# EAGLE schematic Schemat (EAGLE 9.1.0)
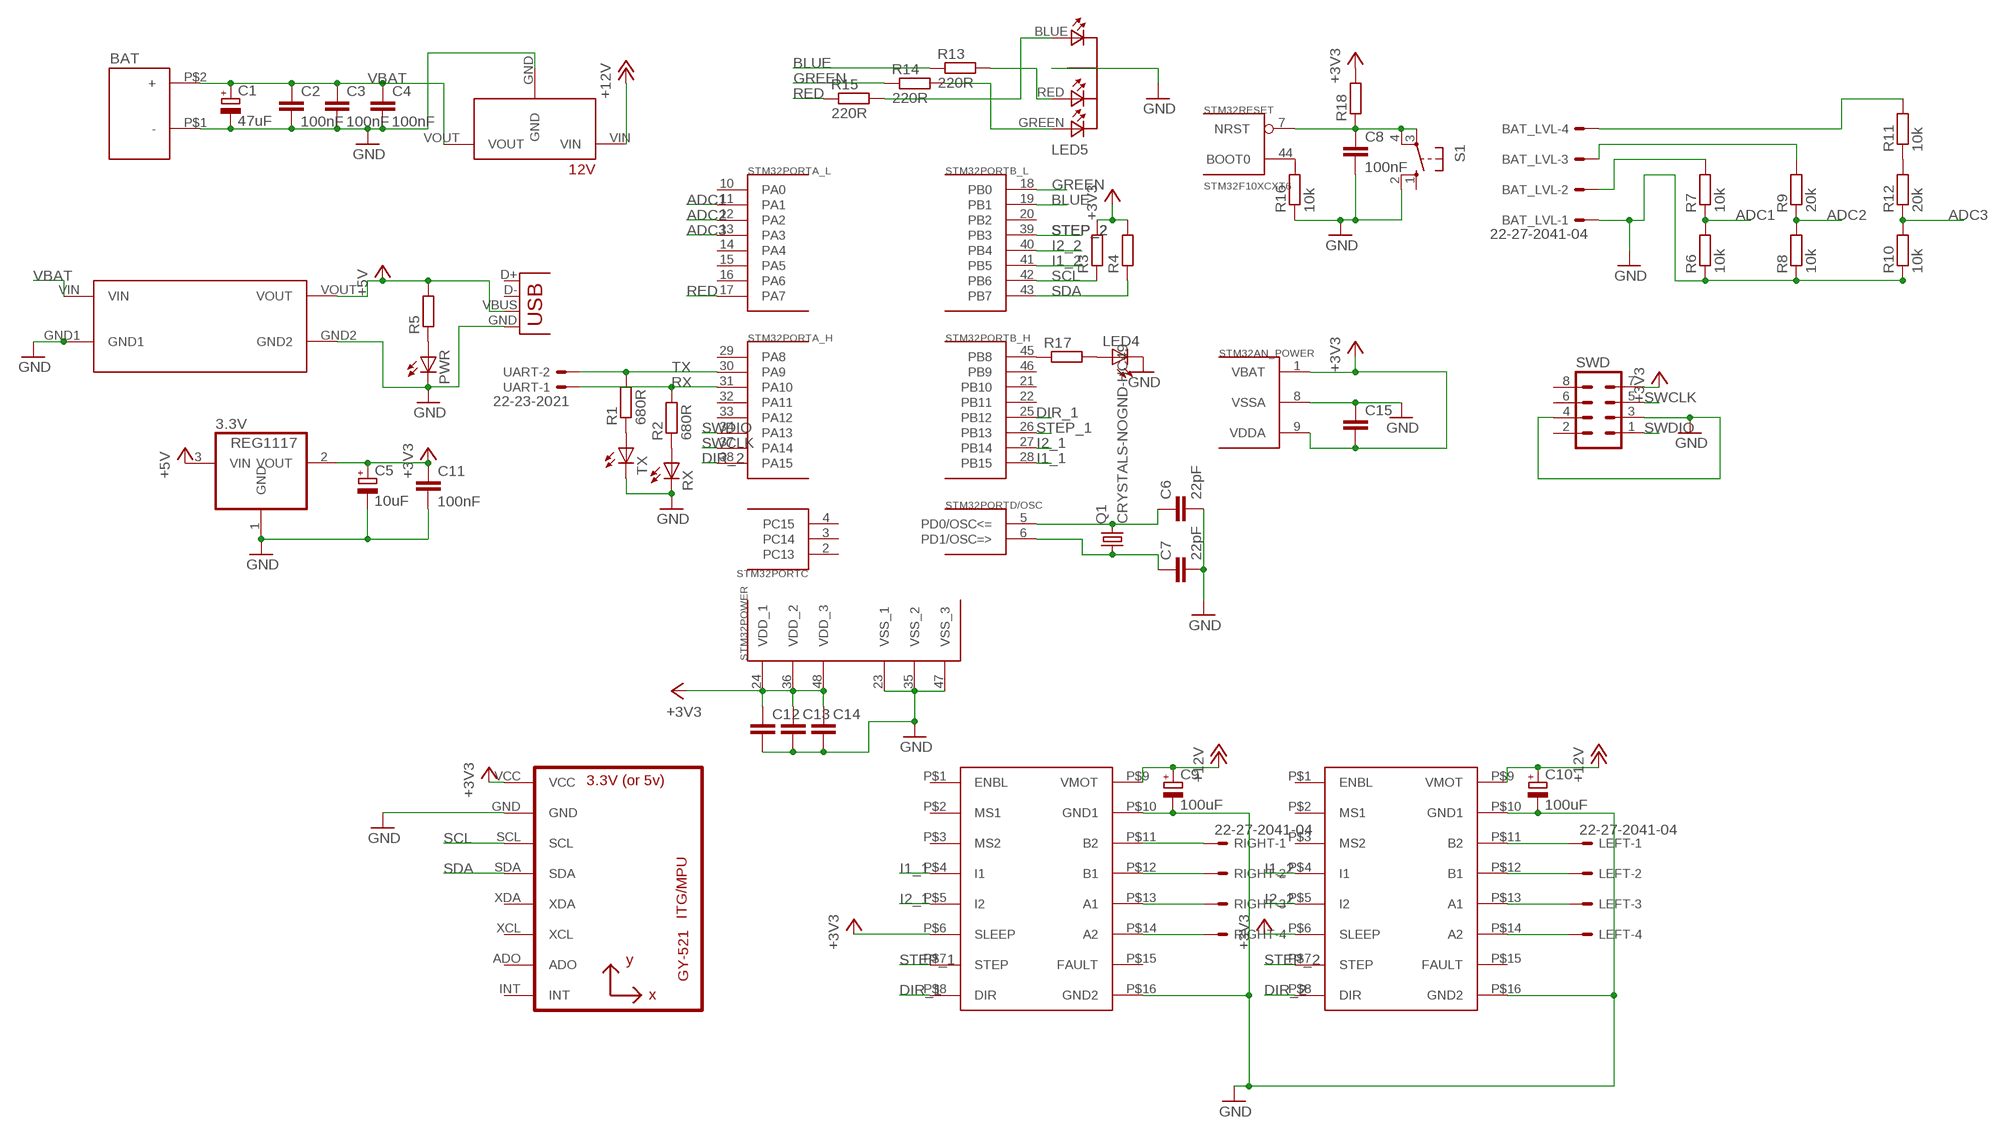
[diagram p0: schematic, sheet 1]

## Parts
3.3V  REG1117  [SOT223]
12V  12V_VOLTAGE_REGULATOR  9V_VOLTAGE_REGULATOR  [9V_VOLTAGE_REGULATOR]
BAT  DEANS  [DEAN]
BAT_LVL  22-27-2041-04  [6410-04]
C1  47uF  CPOL-EUE2-5  [E2-5]
C2  100nF  C-EUC0603K  [C0603K]
C3  100nF  C-EUC0603K  [C0603K]
C4  100nF  C-EUC0603K  [C0603K]
C5  10uF  CPOL-EUE2-5  [E2-5]
C6  22pF  C-EUC0603K  [C0603K]
C7  22pF  C-EUC0603K  [C0603K]
C8  100nF  C-EU050-030X075  [C050-030X075]
C9  100uF  CPOL-EUE2.5-7  [E2,5-7]
C10  100uF  CPOL-EUE2.5-7  [E2,5-7]
C11  100nF  C-EUC0603  [C0603]
C12  C-EU025-024X044  [C025-024X044]
C13  C-EU025-024X044  [C025-024X044]
C14  C-EU025-024X044  [C025-024X044]
C15  C-EU025-024X044  [C025-024X044]
DRV1  POLOLU-MP6500  [STEPPER-CARRIER]
DRV2  POLOLU-MP6500  [STEPPER-CARRIER]
LED4  LED5MM  [LED5MM]
LED5  LED-DIP-3  [DIP-4]
LEFT  22-27-2041-04  [6410-04]
PWR  LED5MM  [LED5MM]
Q1  CRYSTALS-NOGND-HC49  [HC49]
R1  680R  R-EU_R0805  [R0805]
R2  680R  R-EU_R0805  [R0805]
R3  R-EU_R0805  [R0805]
R4  R-EU_R0805  [R0805]
R5  R-EU_R0805  [R0805]
R6  10k  R-EU_R0805  [R0805]
R7  10k  R-EU_R0805  [R0805]
R8  10k  R-EU_R0805  [R0805]
R9  20k  R-EU_R0805  [R0805]
R10  10k  R-EU_R0805  [R0805]
R11  10k  R-EU_R0805  [R0805]
R12  20k  R-EU_R0805  [R0805]
R13  220R  R-EU_R0805  [R0805]
R14  220R  R-EU_R0805  [R0805]
R15  220R  R-EU_R0805  [R0805]
R16  10k  R-EU_R0805  [R0805]
R17  R-EU_R0805  [R0805]
R18  R-EU_R0805  [R0805]
RIGHT  22-27-2041-04  [6410-04]
RPI  USB-A-H  [USB-A-H]
RX  LEDSML0603  [SML0603]
S1  10-XX  [B3F-10XX]
STM32  STM32F10XCXT6  [TQFP48]
SWD  MA04-2  [MA04-2]
TX  LEDSML0603  [SML0603]
U1  GY-521MPU6050  [GY-521]
U$1  DC-DC  [DC-DC]
UART  22-23-2021  [22-23-2021]

## Nets
+3V3: 3.3V.2(VOUT) C5.+ C11.1 C12.1 C13.1 C14.1 C15.2 DRV1.P$6(SLEEP) DRV2.P$6(SLEEP) R3.2 R4.2 R18.2 STM32.1(AN_POWER:VBAT) STM32.9(AN_POWER:VDDA) STM32.24(POWER:VDD_1) STM32.36(POWER:VDD_2) STM32.48(POWER:VDD_3) SWD.7 U1.VCC
+5V: 3.3V.3(VIN) R5.2 RPI.VBUS U$1.VOUT
+12V: 12V.VIN C9.+ C10.+ DRV1.P$9(VMOT) DRV2.P$9(VMOT)
ADC1: R6.2 R7.1 STM32.11(PORTA_L:PA1)
ADC2: R8.2 R9.1 STM32.12(PORTA_L:PA2)
ADC3: R10.2 R12.1 STM32.13(PORTA_L:PA3)
BLUE: R13.1 STM32.19(PORTB_L:PB1)
DIR_1: DRV1.P$8(DIR) STM32.25(PORTB_H:PB12)
DIR_2: DRV2.P$8(DIR) STM32.38(PORTA_H:PA15)
GND: 3.3V.1(GND) 12V.GND BAT.P$1(-) BAT_LVL.1 C1.- C2.2 C3.2 C4.2 C5.- C6.2 C7.2 C8.2 C9.- C10.- C11.2 C12.2 C13.2 C14.2 C15.1 DRV1.P$10(GND1) DRV1.P$16(GND2) DRV2.P$10(GND1) DRV2.P$16(GND2) LED4.K(C) LED5.COMMON_CATHODE(COM-CATHODE) PWR.K(C) R6.1 R8.1 R10.1 R16.1 RPI.GND RX.C S1.2(S1) STM32.8(AN_POWER:VSSA) STM32.23(POWER:VSS_1) STM32.35(POWER:VSS_2) STM32.47(POWER:VSS_3) SWD.3 SWD.4 TX.C U1.GND U$1.GND1 U$1.GND2
GREEN: R14.1 STM32.18(PORTB_L:PB0)
I1_1: DRV1.P$4(I1) STM32.28(PORTB_H:PB15)
I1_2: DRV2.P$4(I1) STM32.41(PORTB_L:PB5)
I2_1: DRV1.P$5(I2) STM32.27(PORTB_H:PB14)
I2_2: DRV2.P$5(I2) STM32.40(PORTB_L:PB4)
N$1: R1.1 TX.A
N$2: R2.1 RX.A
N$3: R16.2 STM32.44(RESET:BOOT0)
N$4: C7.1 Q1.1 STM32.6(PORTD/OSC:PD1/OSC=>)
N$5: LED5.GREEN R14.2
N$6: BAT_LVL.2 R7.2
N$7: PWR.A R5.1
N$8: BAT_LVL.3 R9.2
N$9: R11.1 R12.2
N$10: BAT_LVL.4 R11.2
N$11: C8.1 R18.1 S1.3(P) S1.4(P1) STM32.7(RESET:NRST)
N$13: R17.1 STM32.45(PORTB_H:PB8)
N$14: LED4.A R17.2
N$15: LED5.RED R13.2
N$16: DRV2.P$11(B2) LEFT.1
N$17: LED5.BLUE R15.2
N$18: DRV1.P$12(B1) RIGHT.2
N$19: DRV2.P$12(B1) LEFT.2
N$20: DRV2.P$13(A1) LEFT.3
N$21: DRV2.P$14(A2) LEFT.4
N$22: DRV1.P$11(B2) RIGHT.1
N$23: DRV1.P$13(A1) RIGHT.3
N$24: DRV1.P$14(A2) RIGHT.4
N$26: C6.1 Q1.2 STM32.5(PORTD/OSC:PD0/OSC<=)
RED: R15.1 STM32.17(PORTA_L:PA7)
RX: R2.2 STM32.31(PORTA_H:PA10) UART.1
SCL: R3.1 STM32.42(PORTB_L:PB6) U1.SCL
SDA: R4.1 STM32.43(PORTB_L:PB7) U1.SDA
STEP_1: DRV1.P$7(STEP) STM32.26(PORTB_H:PB13)
STEP_2: DRV2.P$7(STEP) STM32.39(PORTB_L:PB3)
SWCLK: STM32.37(PORTA_H:PA14) SWD.5
SWDIO: STM32.34(PORTA_H:PA13) SWD.1
TX: R1.2 STM32.30(PORTA_H:PA9) UART.2
VBAT: 12V.VOUT BAT.P$2(+) C1.+ C2.1 C3.1 C4.1 U$1.VIN
Unconnected: DRV1.P$1(ENBL) DRV1.P$2(MS1) DRV1.P$3(MS2) DRV1.P$15(FAULT) DRV2.P$1(ENBL) DRV2.P$2(MS1) DRV2.P$3(MS2) DRV2.P$15(FAULT) RPI.D+ RPI.D- S1.1(S) STM32.2(PORTC:PC13) STM32.3(PORTC:PC14) STM32.4(PORTC:PC15) STM32.10(PORTA_L:PA0) STM32.14(PORTA_L:PA4) STM32.15(PORTA_L:PA5) STM32.16(PORTA_L:PA6) STM32.20(PORTB_L:PB2) STM32.21(PORTB_H:PB10) STM32.22(PORTB_H:PB11) STM32.29(PORTA_H:PA8) STM32.32(PORTA_H:PA11) STM32.33(PORTA_H:PA12) STM32.46(PORTB_H:PB9) SWD.2 SWD.6 SWD.8 U1.ADO U1.INT U1.XCL U1.XDA

## Library data of the parts
3.3V = burr-brown:REG1117: 800mA and 1A Low Dropout (LDO) Positive Regulator 1.8V, 2.5V, 2.85V, 3.3V, 5V, and Adj; MPN: REG1117; OC_FARNELL: 1097566; OC_NEWARK: 14P6981
12V = Pololu Voltage Regulators:9V_VOLTAGE_REGULATOR: Polulu 9V Step-Up Voltage Regulator U3V12F9
BAT = DEANS:DEANS; BAT: BAT
BAT_LVL LEFT RIGHT = con-molex:22-?-04: CONNECTOR wire to board 2.54 mm (.1 inch) pitch header; MF: MOLEX; OC_FARNELL: unknown; OC_NEWARK: unknown
C1 C5 C9 C10 = rcl:CPOL-EU: POLARIZED CAPACITOR, European symbol; SPICEPREFIX: C
C2-C4 C6-C8 C11-C15 = rcl:C-EU: CAPACITOR, European symbol; SPICEPREFIX: C
DRV1 DRV2 = Pololu-MP6500:POLOLU-MP6500
LED4 PWR RX TX = led:LED: LED OSRAM: - CHIPLED LG R971, LG N971, LY N971, LG Q971, LY Q971, LO R971, LY R971 LH N974, LH R974 LS Q976, LO Q976, LY Q976 LO Q996 - Hyper CHIPLED LW Q18S LB Q993, LB Q99A, LB R99A - SideLED LS A670, LO A670, LY A670, LG A670, LP A670 LB A673, LV A673, LT A673, LW A673 LH A674 LY A675 LS A676, LA A676, LO A676, LY A676, LW A676 LS A679, LY A679, LG A679 - Hyper Micro SIDELED® LS Y876, LA Y876, LO Y876, LY Y876 LT Y87S - SmartLED LW L88C, LW L88S LB L89C, LB L89S, LG L890 LS L89K, LO L89K, LY L89K LS L896, LA L896, LO L896, LY L896 - TOPLED LS T670, LO T670, LY T670, LG T670, LP T670 LSG T670, LSP T670, LSY T670, LOP T670, LYG T670 LG T671, LOG T671, LSG T671 LB T673, LV T673, LT T673, LW T673 LH T674 LS T676, LA T676, LO T676, LY T676, LB T676, LH T676, LSB T676, LW T676 LB T67C, LV T67C, LT T67C, LS T67K, LO T67K, LY T67K, LW E67C LS E67B, LA E67B, LO E67B, LY E67B, LB E67C, LV E67C, LT E67C LW T67C LS T679, LY T679, LG T679 LS T770, LO T770, LY T770, LG T770, LP T770 LB T773, LV T773, LT T773, LW T773 LH T774 LS E675, LA E675, LY E675, LS T675 LS T776, LA T776, LO T776, LY T776, LB T776 LHGB T686 LT T68C, LB T68C - Hyper Mini TOPLED® LB M676 - Mini TOPLED Santana® LG M470 LS M47K, LO M47K, LY M47K Source: http://www.osram.convergy.de LUXEON: - LUMILED® LXK2-PW12-R00, LXK2-PW12-S00, LXK2-PW14-U00, LXK2-PW14-V00 LXK2-PM12-R00, LXK2-PM12-S00, LXK2-PM14-U00 LXK2-PE12-Q00, LXK2-PE12-R00, LXK2-PE12-S00, LXK2-PE14-T00, LXK2-PE14-U00 LXK2-PB12-K00, LXK2-PB12-L00, LXK2-PB12-M00, LXK2-PB14-N00, LXK2-PB14-P00, LXK2-PB14-Q00 LXK2-PR12-L00, LXK2-PR12-M00, LXK2-PR14-Q00, LXK2-PR14-R00 LXK2-PD12-Q00, LXK2-PD12-R00, LXK2-PD12-S00 LXK2-PH12-R00, LXK2-PH12-S00 LXK2-PL12-P00, LXK2-PL12-Q00, LXK2-PL12-R00 Source: www.luxeon.com KINGBRIGHT: KA-3528ASYC Source: www.kingbright.com
LED5 = _led-rgb:LED-DIP-3: RGB DIP LED Edited: brunql DIP 4 Pin Special for AmbilightUSB
Q1 = IQD-Frequency-Products:CRYSTALS-NOGND: CRYSTALS CAN NOT GROUNDED
R1-R18 = rcl:R-EU_: RESISTOR, European symbol; SPICEPREFIX: R
RPI = con-usb:USB: USB Connectors
S1 = switch-omron:10-XX: OMRON SWITCH; MPN: B3F-1000; OC_FARNELL: 176432; OC_NEWARK: 36M3542
STM32 = stm32:STM32F10XCXT6: ST STM32F101/103 48pin LQFP
SWD = con-lstb:MA04-2: PIN HEADER; OC_FARNELL: unknown; OC_NEWARK: unknown
U1 = gy-521:GY-521
U$1 = DC-DC:DC-DC
UART = con-molex:22-23-2021: .100" (2.54mm) Center Header - 2 Pin; MF: MOLEX; MPN: 22-23-2021; OC_FARNELL: 1462926; OC_NEWARK: 25C3832